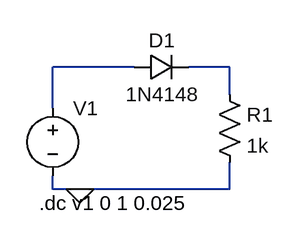
[diagram p0: schematic Forward and Reverse Bais.asc]
Forward and Reverse Bais.asc, the LTspice schematic file:
Version 4
SHEET 1 880 680
WIRE 192 -32 96 -32
WIRE 304 -32 256 -32
WIRE 304 0 304 -32
WIRE 96 16 96 -32
WIRE 96 112 96 96
WIRE 128 112 96 112
WIRE 304 112 304 80
WIRE 304 112 128 112
FLAG 128 112 0
SYMBOL voltage 96 0 R0
WINDOW 123 0 0 Left 0
WINDOW 39 0 0 Left 0
SYMATTR InstName V1
SYMATTR Value ""
SYMBOL diode 192 -16 R270
WINDOW 0 32 32 VTop 2
WINDOW 3 0 32 VBottom 2
SYMATTR InstName D1
SYMATTR Value 1N4148
SYMBOL res 288 -16 R0
SYMATTR InstName R1
SYMATTR Value 1k
TEXT 80 128 Left 2 !.dc v1 0 1 0.025

The netlist it stands for:
* Forward and Reverse Bais.asc
V1 N001 0
D1 N001 N002 1N4148
R1 N002 0 1k
.model D D
.lib standard.dio
.dc v1 0 1 0.025
.backanno
.end